# EAGLE design Polivator (EAGLE 7.7.0)
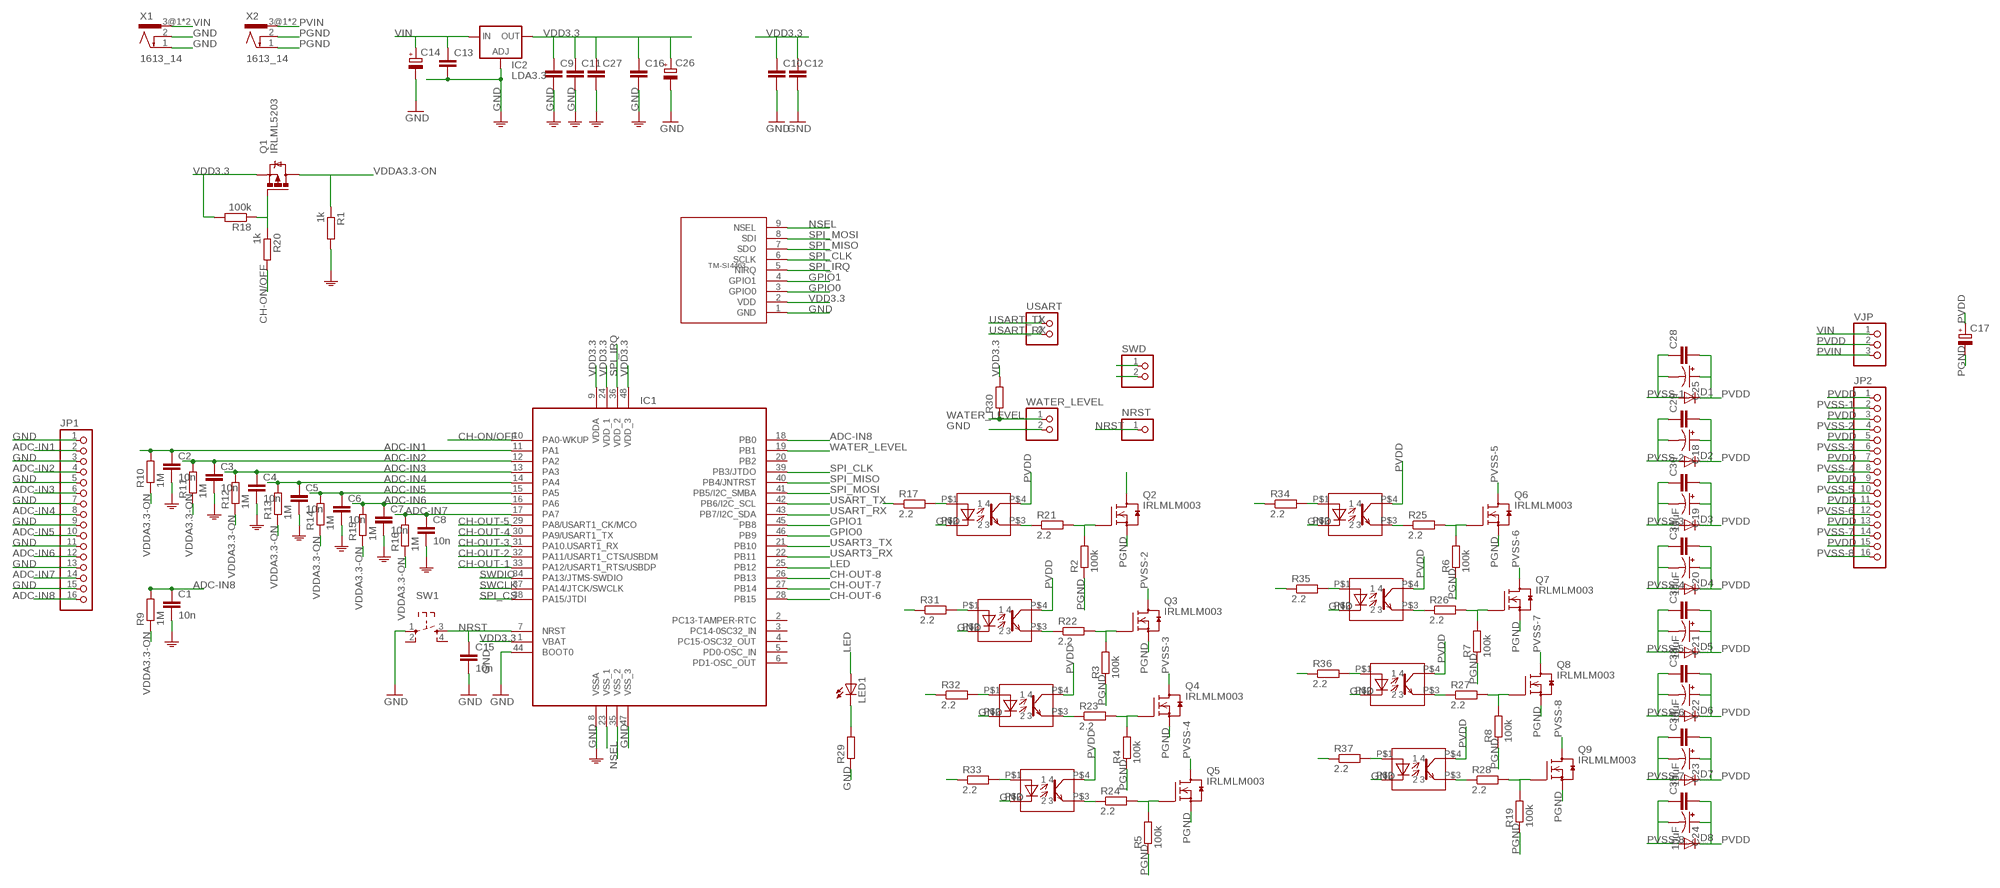
[diagram p0: schematic, sheet 1]

## Parts
C1  10n  C-EUC0805  [C0805]
C2  10n  C-EUC0805  [C0805]
C3  10n  C-EUC0805  [C0805]
C4  10n  C-EUC0805  [C0805]
C5  10n  C-EUC0805  [C0805]
C6  10n  C-EUC0805  [C0805]
C7  10n  C-EUC0805  [C0805]
C8  10n  C-EUC0805  [C0805]
C9  C-EUC3216  [C3216]
C10  C-EUC3216  [C3216]
C11  C-EUC0805  [C0805]
C12  C-EUC0805  [C0805]
C13  C-EUC1808  [C1808]
C14  CPOL-EUE2.5-5  [E2,5-5]
C15  10n  C-EUC0805  [C0805]
C16  C-EUC0805  [C0805]
C17  CPOL-EUE2.5-6  [E2,5-6]
C18  CAP_POL1206  [EIA3216]
C19  10uF  10UF-16V-10%(TANT)  [EIA3216]
C20  10uF  10UF-16V-10%(TANT)  [EIA3216]
C21  10uF  10UF-16V-10%(TANT)  [EIA3216]
C22  10uF  10UF-16V-10%(TANT)  [EIA3216]
C23  10uF  10UF-16V-10%(TANT)  [EIA3216]
C24  10uF  10UF-16V-10%(TANT)  [EIA3216]
C25  CAP_POL1206  [EIA3216]
C26  CPOL-EUE2.5-5  [E2,5-5]
C27  C-EUC0805  [C0805]
C28  C-EUC0805  [C0805]
C29  C-EUC0805  [C0805]
C30  C-EUC0805  [C0805]
C31  C-EUC0805  [C0805]
C32  C-EUC0805  [C0805]
C33  C-EUC0805  [C0805]
C34  C-EUC0805  [C0805]
C35  C-EUC0805  [C0805]
D1  DIODE-SOD80C  [SOD80C]
D2  DIODE-SOD80C  [SOD80C]
D3  DIODE-SOD80C  [SOD80C]
D4  DIODE-SOD80C  [SOD80C]
D5  DIODE-SOD80C  [SOD80C]
D6  DIODE-SOD80C  [SOD80C]
D7  DIODE-SOD80C  [SOD80C]
D8  DIODE-SOD80C  [SOD80C]
IC1  IC_UC_STM32  [LQFP48]
IC2  LDA3.3  LD117ASTR  [SOT223]
JP1  PINHD-1X16  [1X16]
JP2  PINHD-1X16  [1X16]
LED1  LEDCHIPLED_0805  [CHIPLED_0805]
NRST  PINHD-1X1  [1X01]
Q1  IRLML5203  [MICRO3]
Q2  IRLMLM003  BSS138  [SOT23]
Q3  IRLMLM003  BSS138  [SOT23]
Q4  IRLMLM003  BSS138  [SOT23]
Q5  IRLMLM003  BSS138  [SOT23]
Q6  IRLMLM003  BSS138  [SOT23]
Q7  IRLMLM003  BSS138  [SOT23]
Q8  IRLMLM003  BSS138  [SOT23]
Q9  IRLMLM003  BSS138  [SOT23]
R1  1k  R-EU_R0805  [R0805]
R2  100k  R-EU_R0805  [R0805]
R3  100k  R-EU_R0805  [R0805]
R4  100k  R-EU_R0805  [R0805]
R5  100k  R-EU_R0805  [R0805]
R6  100k  R-EU_R0805  [R0805]
R7  100k  R-EU_R0805  [R0805]
R8  100k  R-EU_R0805  [R0805]
R9  1M  R-EU_R0805  [R0805]
R10  1M  R-EU_R0805  [R0805]
R11  1M  R-EU_R0805  [R0805]
R12  1M  R-EU_R0805  [R0805]
R13  1M  R-EU_R0805  [R0805]
R14  1M  R-EU_R0805  [R0805]
R15  1M  R-EU_R0805  [R0805]
R16  1M  R-EU_R0805  [R0805]
R17  2.2  R-EU_R0805  [R0805]
R18  100k  R-EU_R0805  [R0805]
R19  100k  R-EU_R0805  [R0805]
R20  1k  R-EU_R0805  [R0805]
R21  2.2  R-EU_R0805  [R0805]
R22  2.2  R-EU_R0805  [R0805]
R23  2.2  R-EU_R0805  [R0805]
R24  2.2  R-EU_R0805  [R0805]
R25  2.2  R-EU_R0805  [R0805]
R26  2.2  R-EU_R0805  [R0805]
R27  2.2  R-EU_R0805  [R0805]
R28  2.2  R-EU_R0805  [R0805]
R29  R-EU_R0805  [R0805]
R30  R-EU_R0805  [R0805]
R31  2.2  R-EU_R0805  [R0805]
R32  2.2  R-EU_R0805  [R0805]
R33  2.2  R-EU_R0805  [R0805]
R34  2.2  R-EU_R0805  [R0805]
R35  2.2  R-EU_R0805  [R0805]
R36  2.2  R-EU_R0805  [R0805]
R37  2.2  R-EU_R0805  [R0805]
SW1  SW_TACT_4P  [SW_TACT_SMALL]
SWD  PINHD-1X2  [1X02]
U$8  TM-SI4463  [TM-SI4463-SMD]
U$10  PC817-SMD  [PC817-SMD]
U$11  PC817-SMD  [PC817-SMD]
U$13  PC817-SMD  [PC817-SMD]
U$16  PC817-SMD  [PC817-SMD]
U$18  PC817-SMD  [PC817-SMD]
U$20  PC817-SMD  [PC817-SMD]
U$23  PC817-SMD  [PC817-SMD]
U$24  PC817-SMD  [PC817-SMD]
USART  PINHD-1X2  [1X02]
VJP  PINHD-1X3  [1X03]
WATER_LEVEL  PINHD-1X2  [1X02]
X1  1613_14  [1613_14]
X2  1613_14  [1613_14]

## Nets
ADC-IN1: C2.1 IC1.11(PA1) JP1.2 R10.2
ADC-IN2: C3.1 IC1.12(PA2) JP1.4 R11.2
ADC-IN3: C4.1 IC1.13(PA3) JP1.6 R12.2
ADC-IN4: C5.1 IC1.14(PA4) JP1.8 R13.2
ADC-IN5: C6.1 IC1.15(PA5) JP1.10 R14.2
ADC-IN6: C7.1 IC1.16(PA6) JP1.12 R15.2
ADC-IN7: C8.1 IC1.17(PA7) JP1.14 R16.2
ADC-IN8: C1.1 IC1.18(PB0) JP1.16 R9.2
CH-ON/OFF: IC1.10(PA0-WKUP) R20.2
CH-OUT-1: IC1.33(PA12/USART1_RTS/USBDP) R17.1
CH-OUT-2: IC1.32(PA11/USART1_CTS/USBDM) R31.1
CH-OUT-3: IC1.31(PA10.USART1_RX) R32.1
CH-OUT-4: IC1.30(PA9/USART1_TX) R33.1
CH-OUT-5: IC1.29(PA8/USART1_CK/MCO) R34.1
CH-OUT-6: IC1.28(PB15) R35.1
CH-OUT-7: IC1.27(PB14) R36.1
CH-OUT-8: IC1.26(PB13) R37.1
GND: C1.2 C2.2 C3.2 C4.2 C5.2 C6.2 C7.2 C8.2 C9.2 C10.2 C11.2 C12.2 C13.2 C14.- C15.2 C16.2 C26.- C27.2 IC1.8(VSSA) IC1.23(VSS_1) IC1.44(BOOT0) IC1.47(VSS_3) IC2.1(ADJ) JP1.1 JP1.3 JP1.5 JP1.7 JP1.9 JP1.11 JP1.13 JP1.15 R1.2 R29.1 SW1.1 U$8.1(GND) U$10.P$2 U$11.P$2 U$13.P$2 U$16.P$2 U$18.P$2 U$20.P$2 U$23.P$2 U$24.P$2 WATER_LEVEL.2 X1.1 X1.2 ; supply symbol labelled AGND
GPIO0: IC1.46(PB9) U$8.3(GPIO0)
GPIO1: IC1.45(PB8) U$8.4(GPIO1)
LED: IC1.25(PB12) LED1.A
N$1: LED1.C R29.2
N$2: Q2.1(G) R2.2 R21.2
N$3: Q3.1(G) R3.2 R22.2
N$4: Q1.1(G) R18.1 R20.1
N$5: Q4.1(G) R4.2 R23.2
N$6: R21.1 U$10.P$3
N$7: R22.1 U$11.P$3
N$8: Q5.1(G) R5.2 R24.2
N$9: Q6.1(G) R6.2 R25.2
N$10: Q7.1(G) R7.2 R26.2
N$11: Q8.1(G) R8.2 R27.2
N$12: Q9.1(G) R19.2 R28.2
N$13: R23.1 U$13.P$3
N$14: R24.1 U$16.P$3
N$15: R25.1 U$18.P$3
N$16: R26.1 U$20.P$3
N$17: R27.1 U$23.P$3
N$18: R28.1 U$24.P$3
N$19: R17.2 U$10.P$1
N$20: R31.2 U$11.P$1
N$21: R32.2 U$13.P$1
N$22: R33.2 U$16.P$1
N$23: R37.2 U$24.P$1
N$24: R36.2 U$23.P$1
N$25: R35.2 U$20.P$1
N$26: R34.2 U$18.P$1
NRST: C15.1 IC1.7(NRST) NRST.1 SW1.3
NSEL: IC1.35(VSS_2) U$8.9(NSEL)
PGND: C17.- Q2.2(S) Q3.2(S) Q4.2(S) Q5.2(S) Q6.2(S) Q7.2(S) Q8.2(S) Q9.2(S) R2.1 R3.1 R4.1 R5.1 R6.1 R7.1 R8.1 R19.1 X2.1 X2.2
PVDD: C17.+ C18.A(+) C19.A(+) C20.A(+) C21.A(+) C22.A(+) C23.A(+) C24.A(+) C25.A(+) C28.2 C29.2 C30.2 C31.2 C32.2 C33.2 C34.2 C35.2 D1.C D2.C D3.C D4.C D5.C D6.C D7.C D8.C JP2.1 JP2.3 JP2.5 JP2.7 JP2.9 JP2.11 JP2.13 JP2.15 U$10.P$4 U$11.P$4 U$13.P$4 U$16.P$4 U$18.P$4 U$20.P$4 U$23.P$4 U$24.P$4 VJP.2
PVIN: VJP.3 X2.3@1 X2.3@2
PVSS-1: C25.C(-) C28.1 D1.A JP2.2 Q2.3(D)
PVSS-2: C18.C(-) C29.1 D2.A JP2.4 Q3.3(D)
PVSS-3: C19.C(-) C30.1 D3.A JP2.6 Q4.3(D)
PVSS-4: C20.C(-) C31.1 D4.A JP2.8 Q5.3(D)
PVSS-5: C21.C(-) C32.1 D5.A JP2.10 Q6.3(D)
PVSS-6: C22.C(-) C33.1 D6.A JP2.12 Q7.3(D)
PVSS-7: C23.C(-) C34.1 D7.A JP2.14 Q8.3(D)
PVSS-8: C24.C(-) C35.1 D8.A JP2.16 Q9.3(D)
SPI_CLK: IC1.39(PB3/JTDO) U$8.6(SCLK)
SPI_CS: IC1.38(PA15/JTDI)
SPI_IRQ: IC1.36(VDD_2) U$8.5(NIRQ)
SPI_MISO: IC1.40(PB4/JNTRST) U$8.7(SDO)
SPI_MOSI: IC1.41(PB5/I2C_SMBA) U$8.8(SDI)
SWCLK: IC1.37(PA14/JTCK/SWCLK) SWD.2
SWDIO: IC1.34(PA13/JTMS-SWDIO) SWD.1
USART3_RX: IC1.22(PB11)
USART3_TX: IC1.21(PB10)
USART_RX: IC1.43(PB7/I2C_SDA) USART.2
USART_TX: IC1.42(PB6/I2C_SCL) USART.1
VDD3.3: C9.1 C10.1 C11.1 C12.1 C16.1 C26.+ C27.1 IC1.1(VBAT) IC1.9(VDDA) IC1.24(VDD_1) IC1.48(VDD_3) IC2.4(OUT) Q1.2(S) R18.2 R30.2 U$8.2(VDD)
VDDA3.3-ON: Q1.3(D) R1.1 R9.1 R10.1 R11.1 R12.1 R13.1 R14.1 R15.1 R16.1
VIN: C13.1 C14.+ IC2.3(IN) VJP.1 X1.3@1 X1.3@2
WATER_LEVEL: IC1.19(PB1) R30.1 WATER_LEVEL.1
Unconnected: IC1.2(PC13-TAMPER-RTC) IC1.3(PC14-0SC32_IN) IC1.4(PC15-OSC32_OUT) IC1.5(PD0-OSC_IN) IC1.6(PD1-OSC_OUT) IC1.20(PB2) SW1.2 SW1.4

## Library data of the parts
C1-C13 C15 C16 C27-C35 = resistor:C-EU: CAPACITOR, European symbol
C14 C17 C26 = resistor:CPOL-EU: POLARIZED CAPACITOR, European symbol
C18 C25 = SparkFun-Passives:CAP_POL: Capacitor Polarized These are standard SMD and PTH capacitors. Normally 10uF, 47uF, and 100uF in electrolytic and tantalum varieties. Always verify the external diameter of the through hole cap, it varies with capacity, voltage, and manufacturer. The EIA devices should be standard.
C19-C24 = SparkFun-Capacitors:10UF-16V-10%(TANT): CAP-00811 1206/EIA-3216 Tantalum capacitor; PROD_ID: CAP-00811
D1-D8 = diode:DIODE-: DIODE
IC1 = dp_devices:IC_UC_STM32: STM32F102C6
IC2 = v-reg:LD117A?*: Low drop fixed and adjustable positive voltage regulators 1 A Source: http://www.st.com/stonline/products/literature/ds/7194/ld1117axx.pdf
JP1 JP2 = pinhead:PINHD-1X16: PIN HEADER
LED1 = adafruit:LED: LED OSRAM: - CHIPLED LG R971, LG N971, LY N971, LG Q971, LY Q971, LO R971, LY R971 LH N974, LH R974 LS Q976, LO Q976, LY Q976 LO Q996 - Hyper CHIPLED LW Q18S LB Q993, LB Q99A, LB R99A - SideLED LS A670, LO A670, LY A670, LG A670, LP A670 LB A673, LV A673, LT A673, LW A673 LH A674 LY A675 LS A676, LA A676, LO A676, LY A676, LW A676 LS A679, LY A679, LG A679 - Hyper Micro SIDELED® LS Y876, LA Y876, LO Y876, LY Y876 LT Y87S - SmartLED LW L88C, LW L88S LB L89C, LB L89S, LG L890 LS L89K, LO L89K, LY L89K LS L896, LA L896, LO L896, LY L896 - TOPLED LS T670, LO T670, LY T670, LG T670, LP T670 LSG T670, LSP T670, LSY T670, LOP T670, LYG T670 LG T671, LOG T671, LSG T671 LB T673, LV T673, LT T673, LW T673 LH T674 LS T676, LA T676, LO T676, LY T676, LB T676, LH T676, LSB T676, LW T676 LB T67C, LV T67C, LT T67C, LS T67K, LO T67K, LY T67K, LW E67C LS E67B, LA E67B, LO E67B, LY E67B, LB E67C, LV E67C, LT E67C LW T67C LS T679, LY T679, LG T679 LS T770, LO T770, LY T770, LG T770, LP T770 LB T773, LV T773, LT T773, LW T773 LH T774 LS E675, LA E675, LY E675, LS T675 LS T776, LA T776, LO T776, LY T776, LB T776 LHGB T686 LT T68C, LB T68C - Hyper Mini TOPLED® LB M676 - Mini TOPLED Santana® LG M470 LS M47K, LO M47K, LY M47K Source: http://www.osram.convergy.de/
NRST = pinhead:PINHD-1X1: PIN HEADER
Q1 = transistor-power:IRLML5203: HEXFET P-Channel Power MOSFET
Q2-Q9 = m-pad-2.1:BSS138: Fairchild Semiconductors BSS138 N-Channel Logic Level Enhancement Mode Field Effect Transistor General Description: These N-Channel enhancement mode field effect transistors are produced using Fairchild's proprietary, high cell density, DMOS technology. These products have been designed to minimize on-state resistance while provide rugged, reliable, and fast switching performance.These products are particularly suited for low voltage, low current applications such as small servo motor control, power MOSFET gate drivers, and other switching applications. Features: 0.22 A, 50 V. RDS(ON) = 3.5Ohm @ VGS = 10 V RDS(ON) = 6.0Ohm @ VGS = 4.5 V High density cell design for extremely low RDS(ON) Rugged and Reliable Compact industry standard SOT-23 surface mount package Please send any comments to: messi@users.sourceforge.net
R1-R37 = resistor:R-EU_: RESISTOR, European symbol
SW1 = dp_devices:SW_TACT_4P
SWD USART WATER_LEVEL = pinhead:PINHD-1X2: PIN HEADER
U$8 = RemoteSwitchComponents:TM-SI4463
U$10 U$11 U$13 U$16 U$18 U$20 U$23 U$24 = RemoteSwitchComponents:PC817-SMD
VJP = pinhead:PINHD-1X3: PIN HEADER
X1 X2 = con-lumberg:1613_14: Power supply connectors / Netzgeräte-Steckverbinder Source: Data sheet <http://www.farnell.com/datasheets/1733496.pdf>; MF: LUMBERG; MPN: 1613 14; OC_FARNELL: 1243245

## Board
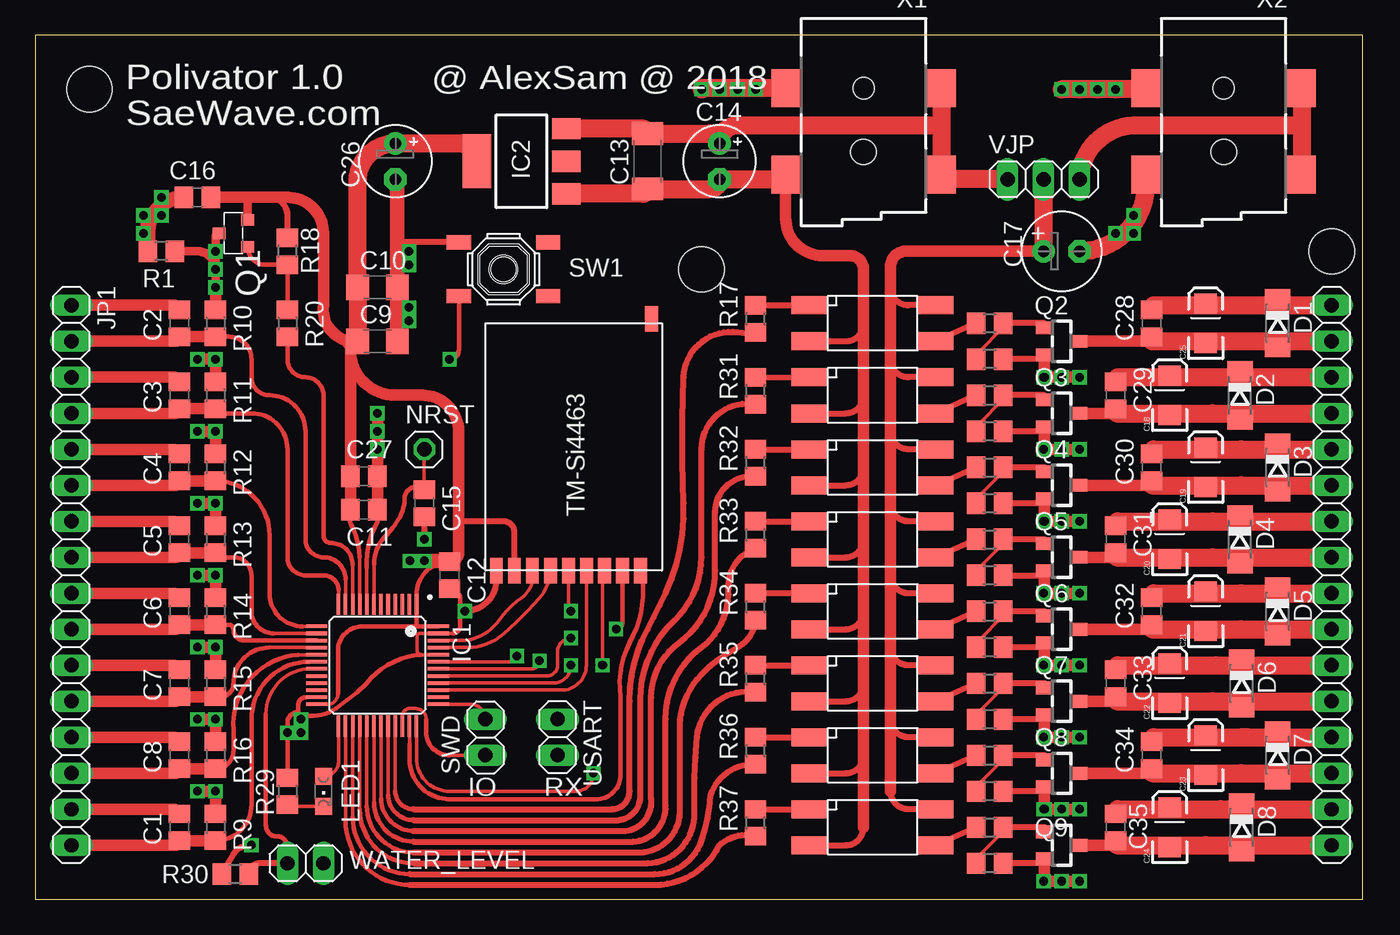
[diagram p1: board, top side]
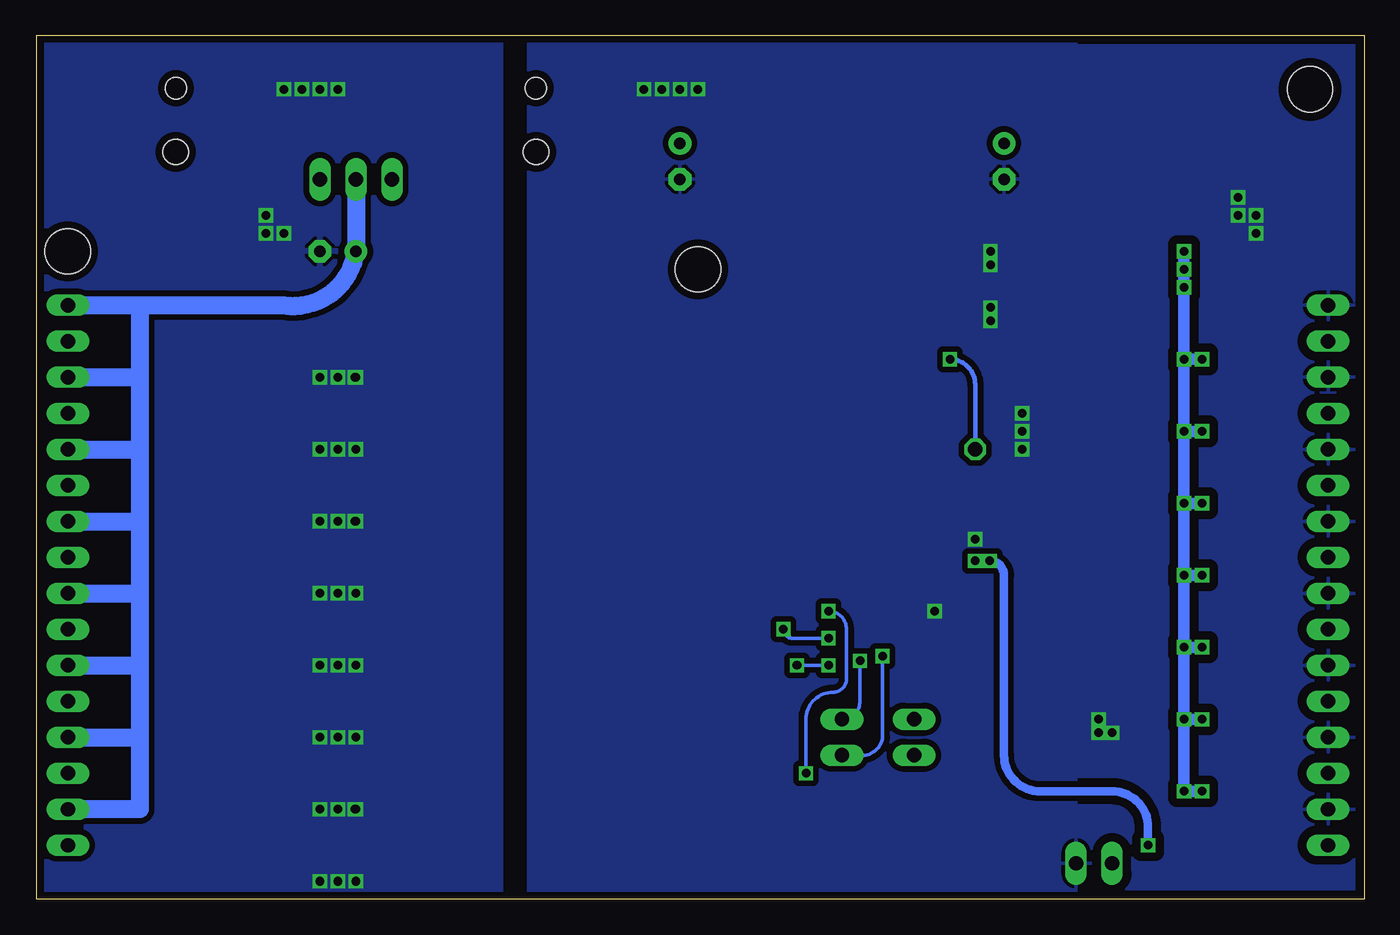
[diagram p2: board, bottom side, seen from below]

Size 93.65 x 60.95 mm. Coordinates in mm from the lower left corner, seen from the top.
Outline: 0,0 93.65,0 93.65,60.95 0,60.95 0,0
Copper layers (1*16): Top 0.035mm / dielectric 1.5mm / Bottom 0.035mm
Design rules "default *": minimum track width 6mil, minimum drill 18mil, track to track 8mil, track to pad 8mil, pad to pad 8mil, via to via 8mil, smd to smd 8mil, copper to edge 20mil, drill to drill 8mil, minimum pad ring 10mil, minimum via ring 8mil, stop-mask expansion 4mil, vias tented up to drill 24mil, thermal gap 10mil
Holes 3.2 mm at 3.81,57.15 91.44,45.72 46.99,44.45

### Footprints (pad centres in the part's own frame; a part is rotated, then mirrored left to right if it is on the bottom)
C0805 = smd 1.3 x 1.5: 1 -0.95,0; 2 0.95,0
C3216 = smd 1.6 x 1.8: 1 -1.4,0; 2 1.4,0
C1808 = smd 1.6 x 2.2: 1 -1.95,0; 2 1.95,0
E2,5-5 = drill 0.813 pad 1.6: + -1.27,0 | drill 0.813 pad 1.6 octagon: - 1.27,0
E2,5-6 = drill 0.813 pad 1.6: + -1.27,0 | drill 0.813 pad 1.6 octagon: - 1.27,0
EIA3216 = smd 1.4 x 1.6: A 1.4,0; C -1.4,0
SOD80C = smd 1.4 x 1.8: A 1.7,0; C -1.7,0
LQFP48 = smd 1.5 x 0.25: 1 -4.3,2.75; 2 -4.3,2.25; 3 -4.3,1.75; 4 -4.3,1.25; 5 -4.3,0.75; 6 -4.3,0.25; 7 -4.3,-0.25; 8 -4.3,-0.75; 9 -4.3,-1.25; 10 -4.3,-1.75; 11 -4.3,-2.25; 12 -4.3,-2.75; 25 4.3,-2.75; 26 4.3,-2.25; 27 4.3,-1.75; 28 4.3,-1.25; 29 4.3,-0.75; 30 4.3,-0.25; 31 4.3,0.25; 32 4.3,0.75; 33 4.3,1.25; 34 4.3,1.75; 35 4.3,2.25; 36 4.3,2.75 | smd 0.25 x 1.5: 13 -2.75,-4.3; 14 -2.25,-4.3; 15 -1.75,-4.3; 16 -1.25,-4.3; 17 -0.75,-4.3; 18 -0.25,-4.3; 19 0.25,-4.3; 20 0.75,-4.3; 21 1.25,-4.3; 22 1.75,-4.3; 23 2.25,-4.3; 24 2.75,-4.3; 37 2.75,4.3; 38 2.25,4.3; 39 1.75,4.3; 40 1.25,4.3; 41 0.75,4.3; 42 0.25,4.3; 43 -0.25,4.3; 44 -0.75,4.3; 45 -1.25,4.3; 46 -1.75,4.3; 47 -2.25,4.3; 48 -2.75,4.3
SOT223 = smd 1.5 x 2: 1 -2.3,-3.15; 2 0,-3.15; 3 2.3,-3.15 | smd 3.8 x 2: 4 0,3.15
1X16 = drill 1.016 long: 1 -19.05,0; 2 -16.51,0; 3 -13.97,0; 4 -11.43,0; 5 -8.89,0; 6 -6.35,0; 7 -3.81,0; 8 -1.27,0; 9 1.27,0; 10 3.81,0; 11 6.35,0; 12 8.89,0; 13 11.43,0; 14 13.97,0; 15 16.51,0; 16 19.05,0
CHIPLED_0805 = smd 1.2 x 1.2: A 0,-1.05; C 0,1.05
1X01 = drill 1.016 octagon: 1 0,0
MICRO3 = smd 0.8 x 0.9: 1 -0.95,-1; 2 0.95,-1; 3 0,1
SOT23 = smd 0.9 x 1.2: 1 -0.95,-1.2; 2 0.95,-1.2; 3 0,1.2
R0805 = smd 1.3 x 1.5: 1 -0.95,0; 2 0.95,0
SW_TACT_SMALL = smd 1.7 x 1: 1 -3.15,1.9; 2 3.15,1.9; 3 -3.15,-1.9; 4 3.15,-1.9
1X02 = drill 1.016 long: 1 -1.27,0; 2 1.27,0
TM-SI4463-SMD = smd 1.778 x 0.914: 1 8.572,-5.588; 2 8.572,-4.318; 3 8.572,-3.048; 4 8.572,-1.778; 5 8.572,-0.508; 6 8.572,0.762; 7 8.572,2.032; 8 8.572,3.302; 9 8.572,4.572; 10 -9.207,5.366
PC817-SMD = smd 2.54 x 1.27: P$1 -4.445,1.27; P$2 -4.445,-1.27; P$3 4.445,-1.27; P$4 4.445,1.27
1X03 = drill 1.016 long: 1 -2.54,0; 2 0,0; 3 2.54,0
1613_14 = smd 2 x 2.7: 1 5.5,5; 2 5.5,11.1; 3@1 -5.5,11.1; 3@2 -5.5,5 | hole 1.5: 0,5 | hole 1.8: 0,9.5

### Placement (x,y rotation side)
C1  10.16,5.08 90 top
C2  10.16,40.64 90 top
C3  10.16,35.56 90 top
C4  10.16,30.48 90 top
C5  10.16,25.4 90 top
C6  10.16,20.32 90 top
C7  10.16,15.24 90 top
C8  10.16,10.16 90 top
C9  24.13,39.37 0 top
C10  24.13,43.18 0 top
C11  23.18,27.49 0 top
C12  29.21,22.86 270 top
C13  43.18,52.07 270 top
C14  48.26,52.07 270 top
C15  27.43,27.94 270 top
C16  11.43,49.53 180 top
C17  72.39,45.72 0 top
C18  80.01,35.56 90 top
C19  82.55,30.48 90 top
C20  80.01,25.4 90 top
C21  82.55,20.32 90 top
C22  80.01,15.24 90 top
C23  82.55,10.16 90 top
C24  80.01,5.08 90 top
C25  82.55,40.64 90 top
C26  25.4,52.07 270 top
C27  23.18,29.84 0 top
C28  78.74,40.64 90 top
C29  76.2,35.56 90 top
C30  78.74,30.48 90 top
C31  76.2,25.4 90 top
C32  78.74,20.32 90 top
C33  76.2,15.24 90 top
C34  78.74,10.16 90 top
C35  76.2,5.08 90 top
D1  87.63,40.64 270 top
D2  84.96,35.56 270 top
D3  87.63,30.48 270 top
D4  84.96,25.4 270 top
D5  87.63,20.32 270 top
D6  85.09,15.24 270 top
D7  87.63,10.16 270 top
D8  85.09,5.08 270 top
IC1  24.13,16.51 270 top
IC2  34.29,52.07 90 top
JP1  2.54,22.86 270 top
JP2  91.44,22.86 270 top
LED1  20.32,7.62 180 top
NRST  27.43,31.75 0 top
Q1  13.97,46.99 90 top
Q2  72.39,39.37 270 top
Q3  72.39,34.29 270 top
Q4  72.39,29.21 270 top
Q5  72.39,24.13 270 top
Q6  72.39,19.05 270 top
Q7  72.39,13.97 270 top
Q8  72.39,8.89 270 top
Q9  72.39,3.81 270 top
R1  8.89,45.72 180 top
R2  67.31,38.1 180 top
R3  67.31,33.02 180 top
R4  67.31,27.94 180 top
R5  67.31,22.86 180 top
R6  67.31,17.78 180 top
R7  67.31,12.7 180 top
R8  67.31,7.62 180 top
R9  12.7,5.08 270 top
R10  12.7,40.64 270 top
R11  12.7,35.56 270 top
R12  12.7,30.48 270 top
R13  12.7,25.4 270 top
R14  12.7,20.32 270 top
R15  12.7,15.24 270 top
R16  12.7,10.16 270 top
R17  50.8,40.96 90 top
R18  17.78,45.72 90 top
R19  67.31,2.54 180 top
R20  17.78,40.64 270 top
R21  67.31,40.64 0 top
R22  67.31,35.56 0 top
R23  67.31,30.48 0 top
R24  67.31,25.4 0 top
R25  67.31,20.32 0 top
R26  67.31,15.24 0 top
R27  67.31,10.16 0 top
R28  67.31,5.08 0 top
R29  17.78,7.62 270 top
R30  14.1,1.78 180 top
R31  50.8,35.88 90 top
R32  50.8,30.8 90 top
R33  50.8,25.72 90 top
R34  50.8,20.64 90 top
R35  50.8,15.56 90 top
R36  50.8,10.48 90 top
R37  50.8,5.4 90 top
SW1  33.02,44.45 0 top
SWD  31.75,11.43 90 top
U$8  38.1,31.75 270 top
U$10  59.05,40.64 0 top
U$11  59.05,35.56 0 top
U$13  59.05,30.48 0 top
U$16  59.05,25.4 0 top
U$18  59.05,20.32 0 top
U$20  59.05,15.24 0 top
U$23  59.05,10.16 0 top
U$24  59.05,5.08 0 top
USART  36.83,11.43 270 top
VJP  71.12,50.8 0 top
WATER_LEVEL  19.05,2.54 0 top
X1  58.42,62.23 180 top
X2  83.82,62.23 180 top

### Tracks (layer width: path | path; a pad name or v marks a point on that pad's centre or on a via)
ADC-IN1
  Top 0.254: IC1.11 21.88,22.57
  Top 0.305: 21.88,22.57 arc90 20.32,24.13 arc-90 19.05,25.4 19.05,33.02 arc90 16.51,35.56 arc-90 15.24,36.83 15.24,38.1 arc90 13.65,39.69 R10.2
  Top 0.813: JP1.2 9.84,39.37 arc90 C2.1 R10.2
ADC-IN2
  Top 0.254: IC1.12 21.38,21.8 | 13.02,34.29 arc-90 R11.2
  Top 0.305: 21.38,21.8 arc90 20.32,22.86 19.05,22.86 arc-90 17.78,24.13 17.78,31.75 arc90 15.24,34.29 13.02,34.29
  Top 0.813: JP1.4 9.84,34.29 arc90 C3.1 R11.2
ADC-IN3
  Top 0.254: IC1.13 18.84,19.26
  Top 0.305: 18.84,19.26 arc-90 16.51,21.59 16.51,25.72 arc90 R12.2
  Top 0.813: JP1.6 9.84,29.21 arc90 C4.1 R12.2
ADC-IN4
  Top 0.254: IC1.14 16.8,18.76 | 13.02,24.13 arc-90 R13.2
  Top 0.305: 16.8,18.76 arc-90 15.24,20.32 15.24,22.86 arc90 13.97,24.13 13.02,24.13
  Top 0.813: JP1.8 9.84,24.13 arc90 C5.1 R13.2
ADC-IN5
  Top 0.305: IC1.15 14.76,18.26 arc-90 13.97,19.05 arc90 13.65,19.37 R14.2
  Top 0.813: JP1.10 9.84,19.05 arc90 C6.1 R14.2
ADC-IN6
  Top 0.254: IC1.16 16.49,17.76 | 13.02,14.29 R15.2
  Top 0.305: 16.49,17.76 arc90 13.97,15.24 arc-90 13.02,14.29
  Top 0.813: JP1.12 9.84,13.97 arc90 C7.1 R15.2
ADC-IN7
  Top 0.254: IC1.17 18.53,17.26
  Top 0.305: 18.53,17.26 arc90 13.97,11.94 13.97,10.48 arc-90 R16.2
  Top 0.813: JP1.14 9.84,8.89 arc90 C8.1 R16.2
ADC-IN8
  Top 0.254: IC1.18 19.3,16.76
  Top 0.305: 19.3,16.76 arc90 15.24,12.7 15.24,6.67 arc-90 R9.2
  Top 0.813: JP1.16 9.84,3.81 arc90 C1.1 R9.2
CH-ON/OFF
  Top 0.254: IC1.10 22.38,23.59
  Top 0.305: 22.38,23.59 arc90 20.83,25.15 arc-90 20.32,25.65 20.32,35.56 arc90 19.05,36.83 arc-90 17.78,38.1 R20.2
CH-OUT-1
  Top 0.254: IC1.33 25.38,7.64
  Top 0.305: 25.38,7.64 arc90 26.67,6.35
  Top 0.406: 26.67,6.35 40.64,6.35 arc90 41.91,7.62 41.91,13.97 arc-28 43.18,19.05 arc3 44.45,21.59 arc27 45.72,27.94 arc-5 45.72,36.83 arc-95 49.53,40.01 arc16 R17.1
CH-OUT-2
  Top 0.254: IC1.32 24.88,7.38
  Top 0.305: 24.88,7.38 arc90 26.67,5.59
  Top 0.406: 26.67,5.59 41.15,5.59 arc90 42.67,7.49 42.67,14.1 arc-47 45.09,19.68 arc47 46.99,24.13 arc-1 46.99,31.75 arc-100 R31.1
CH-OUT-3
  Top 0.254: IC1.31 24.38,7.12
  Top 0.305: 24.38,7.12 arc90 26.67,4.83
  Top 0.406: 26.67,4.83 41.66,4.83 arc90 43.43,7.11 43.43,14.22 arc-54 45.4,18.1 arc55 47.94,23.18 arc-1 47.94,27.3 arc-95 R32.1
CH-OUT-4
  Top 0.254: IC1.30 23.88,6.85
  Top 0.305: 23.88,6.85 arc90 26.67,4.06
  Top 0.406: 26.67,4.06 42.16,4.06 arc90 44.45,6.6 44.45,12.7 arc-53 46.99,17.78 arc57 48.9,21.91 arc-74 R33.1 50.16,24.45
CH-OUT-5
  Top 0.254: IC1.29 23.38,6.59
  Top 0.305: 23.38,6.59 arc90 26.67,3.3
  Top 0.406: 26.67,3.3 42.67,3.3 arc90 45.47,6.35 45.47,12.13 arc-44 46.99,15.88 arc-18 49.53,17.78 arc57 R34.1
CH-OUT-6
  Top 0.254: IC1.28 22.88,6.33
  Top 0.305: 22.88,6.33 arc90 26.67,2.54
  Top 0.406: 26.67,2.54 43.18,2.54 arc90 46.48,6.1 46.48,7.11 arc-5 46.67,11.43 arc-95 R35.1
CH-OUT-7
  Top 0.254: IC1.27 22.38,5.81
  Top 0.305: 22.38,5.81 arc90 26.42,1.78
  Top 0.406: 26.42,1.78 43.69,1.78 arc71 46.99,4.13 arc16 47.62,7.3 arc-76 R36.1
CH-OUT-8
  Top 0.254: IC1.26 21.88,5.55
  Top 0.305: 21.88,5.55 arc90 26.42,1.02
  Top 0.406: 26.42,1.02 43.69,1.02 arc40 46.99,2.22 arc22 48.26,3.81 arc-58 R37.1
GND  (via drill 0.6)  (1 unrouted)
  Top 0.254: 24.13,26.67 arc62 C11.2 | IC1.8 23.38,23.36 23.37,23.37 | 29.43,18.76 IC1.47 27.14,18.76 arc90 26.92,18.54 26.92,17.53 arc90 27.19,17.26 IC1.44 | IC1.23 19.09,14.26
  Top 0.305: 19.09,14.26 arc90 18.54,13.72 18.54,13.21 | 18.54,13.21 arc90 19.05,12.95 arc41 21.21,13.46 arc8 23.37,15.24 arc-48 27.19,17.26 | R29.1 v17.78,11.75 | v17.78,11.75 17.78,12.45 arc-90 18.54,13.21 | v18.73,12.7 v18.73,11.75 v17.78,11.75 | 23.37,23.37 arc-31 24.13,26.67 | 29.43,18.76 arc90 29.97,19.3 29.97,20.32 29.97,21.15 arc90 C12.2
  Top 0.406: C15.2 v27.43,25.4 | 29.97,20.32 v30.29,20.32 arc90 32.51,22.54 U$8.1 | v8.89,49.53 v8.89,48.26 v7.62,48.26 v7.62,46.99 7.94,46.99 | 25.53,50.67 arc90 C26.- | SW1.1 26.17,46.35 arc-90 25.53,46.99 | 9.84,41.91 arc90 C2.2 | 9.84,36.83 arc90 C3.2 | 9.84,31.75 arc90 C4.2 | 9.84,26.67 arc90 C5.2 | 9.84,21.59 arc90 C6.2 | 9.84,16.51 arc90 C7.2 | 9.84,11.43 arc90 C8.2 | 9.84,6.35 arc90 C1.2 | U$23.P$2 57.15,8.89 arc90 58.42,10.16 | U$24.P$2 57.15,3.81 arc90 58.42,5.08 | U$20.P$2 57.15,13.97 arc90 58.42,15.24 | U$18.P$2 57.15,19.05 arc90 58.42,20.32 | U$16.P$2 57.15,24.13 arc90 58.42,25.4 | U$13.P$2 57.15,29.21 arc90 58.42,30.48 | U$11.P$2 57.15,34.29 arc90 58.42,35.56 | U$10.P$2 57.15,39.37 arc90 58.42,40.64
  Top 0.813: 9.84,41.91 JP1.1 | 9.84,36.83 JP1.3 | 9.84,31.75 JP1.5 | 9.84,26.67 JP1.7 | 9.84,21.59 JP1.9 | 9.84,16.51 JP1.11 | 9.84,11.43 JP1.13 | 9.84,6.35 JP1.15 | 58.42,5.08 58.42,10.16 58.42,15.24 58.42,20.32 58.42,25.4 58.42,30.48 58.42,35.56 58.42,40.64 58.42,44.45 arc90 57.47,45.4 55.56,45.4 arc-90 52.92,48.05 X1.2 | v24.13,34.29 C27.2 C11.2
  Top 1.016: C16.2 arc90 7.94,46.99 R1.2 | C9.2 C10.2 25.53,46.99 25.53,50.67 arc90 C26.-
  Top 1.27: IC2.1 42.83,49.77 arc90 C13.2 47.58,50.12 arc90 C14.- 52.59,50.8 arc90 X1.2 | 25.53,50.67 arc90 C26.- | X1.1 47.07,57.23 arc90 v46.99,57.15
  other vias: 24.13,33.02 24.13,31.75 48.26,57.15 49.53,57.15 50.8,57.15 26.35,40.8 26.35,41.75 26.35,45.72 26.35,44.77
  pour Bottom (isolate 0.61): 0,60.96 30.48,60.96 30.48,40.64 arc-90 27.94,38.1 22.86,38.1 arc90 20.32,34.29 20.32,0 0,0
  pour Bottom (isolate 0.406, rank 2): 20.32,0 20.32,60.96 58.93,61.21 58.93,0
GPIO0
  Top 0.254: IC1.46 30,18.26 arc56 32.7,19.68 arc-21 34.29,21.27 arc68 U$8.3
GPIO1
  Top 0.254: IC1.45 30.46,17.76 arc42 33.02,18.73 arc7 35.56,21.27 arc40 U$8.4
LED
  Top 0.254: IC1.25 21.38,9.73 arc-90 LED1.A
N$1
  Top 0.254: LED1.C 17.88,6.57 arc-90 R29.2
N$2
  Top 0.152: R2.2 66.26,38.25 66.22,38.28
  Top 0.254: 66.04,38.1 66.22,38.28 68.58,40.64
  Top 0.406: Q2.1 71.19,40.64 68.58,40.64 R21.2
N$3
  Top 0.152: R3.2 66.26,33.25 66.27,33.24
  Top 0.254: 66.04,33.02 66.27,33.24 68.58,35.56
  Top 0.406: Q3.1 71.19,35.56 68.58,35.56 R22.2
N$4
  Top 0.305: R20.1 R18.1 16.24,44.77 arc-90 Q1.1
N$5
  Top 0.152: R4.2 66.26,28 66.18,28.08
  Top 0.254: 66.04,27.94 66.18,28.08 68.58,30.48
  Top 0.406: Q4.1 71.19,30.48 68.58,30.48 R23.2
N$6
  Top 0.406: U$10.P$3 R21.1
N$7
  Top 0.406: U$11.P$3 R22.1
N$8
  Top 0.152: R5.2 66.26,23 66.22,23.04
  Top 0.254: 66.04,22.86 66.22,23.04 68.58,25.4
  Top 0.406: Q5.1 71.19,25.4 68.58,25.4 R24.2
N$9
  Top 0.152: 66.26,18 R6.2
  Top 0.254: 66.04,17.78 66.26,18 68.58,20.32
  Top 0.406: Q6.1 71.19,20.32 68.58,20.32 R25.2
N$10
  Top 0.152: R7.2 66.26,12.75 66.17,12.84
  Top 0.254: 66.04,12.7 66.17,12.84 68.58,15.24
  Top 0.406: Q7.1 71.19,15.24 68.58,15.24 R26.2
N$11
  Top 0.152: R8.2 66.26,7.75 66.22,7.79
  Top 0.254: 66.04,7.62 66.22,7.79 68.58,10.16
  Top 0.406: Q8.1 71.19,10.16 68.58,10.16 R27.2
N$12
  Top 0.152: R19.2 66.26,2.75 66.25,2.75
  Top 0.254: 66.04,2.54 66.25,2.75 68.58,5.08
  Top 0.406: Q9.1 71.19,5.08 68.58,5.08 R28.2
N$13
  Top 0.406: U$13.P$3 R23.1
N$14
  Top 0.406: U$16.P$3 R24.1
N$15
  Top 0.406: U$18.P$3 R25.1
N$16
  Top 0.406: U$20.P$3 R26.1
N$17
  Top 0.406: U$23.P$3 R27.1
N$18
  Top 0.406: U$24.P$3 R28.1
N$19
  Top 0.406: R17.2 U$10.P$1
N$20
  Top 0.406: R31.2 U$11.P$1
N$21
  Top 0.406: R32.2 U$13.P$1
N$22
  Top 0.406: R33.2 U$16.P$1
N$23
  Top 0.406: R37.2 U$24.P$1
N$24
  Top 0.406: R36.2 U$23.P$1
N$25
  Top 0.406: R35.2 U$20.P$1
N$26
  Top 0.406: U$18.P$1 R34.2 arc90 R34.2
NRST  (via drill 0.6)
  Top 0.254: IC1.7 23.88,23.63 | NRST.1 C15.1
  Top 0.305: 23.88,23.63 arc-46 24.77,25.72 arc18 25.72,26.99 arc28 26.04,28.26 arc-131 C15.1 | SW1.3 29.87,38.76 arc-90 v29.21,38.1
  Bottom 0.305: v29.21,38.1 arc90 27.43,36.32 NRST.1
NSEL
  Top 0.254: IC1.35 26.38,10.96
  Top 0.305: 29.21,7.06 39.38,7.06 arc90 41.27,8.64 41.27,14.29 arc-34 41.91,18.1 arc31 42.86,21.91 arc16 U$8.9 | 29.21,7.06 29.06,7.06 | 26.38,10.96 26.38,9.89 arc90 29.21,7.06
PGND  (via drill 0.6)
  Top 0.152: v71.19,6.35 71.26,6.25 v71.12,6.35 | v71.12,26.67 71.26,26.75 v71.19,26.67 | v71.19,36.83 71.26,36.75 v71.12,36.83
  Top 0.406: Q2.2 71.19,38.1 R2.1 | Q3.2 71.19,33.02 R3.1 | Q4.2 71.19,27.94 R4.1 | Q6.2 71.19,17.78 R6.1 | Q7.2 71.19,12.7 R7.1 | Q8.2 71.19,7.62 R8.1 | Q9.2 71.19,2.54 R19.1 | R5.1 70.87,22.86 arc90 Q5.2
  Top 0.813: Q2.2 v71.19,36.83 v72.39,36.83 v73.66,36.83 | Q3.2 71.19,31.75 v72.39,31.75 v73.66,31.75 | Q4.2 v71.19,26.67 v72.39,26.67 v73.66,26.67 | Q5.2 71.19,21.59 v72.39,21.59 v73.66,21.59 | Q6.2 71.19,16.51 v72.39,16.51 v73.66,16.51 | Q7.2 71.19,11.43 v72.39,11.43 v73.66,11.43 | Q8.2 v71.19,6.35 v72.39,6.35 v73.66,6.35 | Q9.2 71.19,1.27 v72.39,1.27 v73.66,1.27
  Top 1.27: X2.2 78.32,50.38 arc-90 C17.- | X2.1 arc-90 78.24,57.15 v76.2,57.15 v74.93,57.15 v73.66,57.15 v72.39,57.15
  other vias: 71.12,1.27 71.12,11.43 71.12,16.51 71.12,21.59 71.12,31.75 77.47,48.26 76.2,46.99 77.47,46.99
  pour Bottom (isolate 0.406): 93.98,60.96 60.96,60.96 60.96,0 93.98,0
PVDD
  Top 0.152: D6.C 83.3,17 83.3,16.51 | 85.3,11.5 85.3,11.43 | D5.C 85.05,22 85.05,21.59 | D4.C 83.05,27 83.05,26.67 | D3.C 85.05,32.25 85.05,31.75 | D2.C 83.05,37.25 83.05,36.83 | D1.C 85.05,42.25 85.05,41.91
  Top 0.254: 78.87,41.91 78.87,41.72 arc-90 C28.2 | 76.33,36.83 76.33,36.64 arc-90 C29.2 | 78.87,31.75 78.87,31.56 arc-90 C30.2 | 76.33,26.67 76.33,26.48 arc-90 C31.2 | 78.87,21.59 78.87,21.4 arc-90 C32.2 | 76.33,16.51 76.33,16.32 arc-90 C33.2 | 78.87,11.43 78.87,11.24 arc-90 C34.2 | 76.33,6.35 76.33,6.16 arc-90 C35.2 | 85.09,11.43 85.52,11.43 87.2,11.43 arc90 D7.C
  Top 0.406: U$24.P$4 61.59,6.35 arc-90 60.33,7.62 | U$23.P$4 61.59,11.43 arc-90 60.33,12.7 | U$20.P$4 61.59,16.51 arc-90 60.33,17.78 | U$18.P$4 61.59,21.59 arc-90 60.33,22.86 | U$16.P$4 61.59,26.67 arc-90 60.33,27.94 | U$13.P$4 61.59,31.75 arc-90 60.33,33.02 | U$11.P$4 61.59,36.83 arc-90 60.33,38.1 | U$10.P$4 61.59,41.91 arc-90 60.33,43.18
  Top 0.813: 60.33,7.62 60.33,12.7 60.33,17.78 60.33,22.86 60.33,27.94 60.33,33.02 60.33,38.1 60.33,43.18 60.33,44.45 arc-90 61.28,45.72 C17.+
  Top 1.016: D8.C 83.61,6.35 | C23.A 78.87,11.43 | C24.A 76.33,6.35 | C22.A 76.33,16.51 | C21.A 78.87,21.59 | C20.A 76.33,26.67 | C18.A 76.33,36.83 | C19.A 78.87,31.75 | C25.A 78.87,41.91
  Top 1.27: JP2.15 83.61,6.35 76.33,6.35 | 76.33,16.51 83.3,16.51 JP2.11 | 78.87,21.59 85.05,21.59 JP2.9 | 76.33,26.67 83.05,26.67 JP2.7 | 76.33,36.83 83.05,36.83 JP2.3 | 78.87,31.75 85.05,31.75 JP2.5 | 78.87,11.43 85.09,11.43 85.3,11.43 85.52,11.43 JP2.13 | 78.87,41.91 85.05,41.91 JP2.1 | VJP.2 C17.+
  Bottom 1.27: 86.36,41.91 86.36,36.83 | 86.36,36.83 86.36,31.75 | 86.36,31.75 86.36,26.67 | 86.36,26.67 86.36,21.59 | 86.36,21.59 86.36,16.51 | 86.36,16.51 86.36,11.43 | 86.36,11.43 86.36,6.35 JP2.15 | JP2.13 86.36,11.43 | JP2.11 86.36,16.51 | JP2.9 86.36,21.59 | JP2.7 86.36,26.67 | JP2.5 86.36,31.75 | JP2.3 86.36,36.83 | JP2.1 86.36,41.91 | 86.36,41.91 76.2,41.91 arc-90 C17.+ VJP.2
PVIN
  Top 1.27: X2.3@2 89.32,54.61 | 89.32,54.61 X2.3@1 | VJP.3 arc-90 77.79,54.61 89.32,54.61
PVSS-1
  Top 0.152: C25.C 81.3,39.25 78.76,39.37 | 85.05,39.37 85.05,39 D1.A
  Top 0.254: C28.1 78.74,39.39 arc90 78.76,39.37
  Top 0.813: Q2.3 78.76,39.37
  Top 1.27: 78.76,39.37 85.05,39.37 JP2.2
PVSS-2
  Top 0.152: C18.C 78.8,34.25 76.26,34.29 | 83.05,34.29 83.05,34 D2.A
  Top 0.254: C29.1 76.2,34.29
  Top 0.813: Q3.3 76.2,34.29 76.26,34.29
  Top 1.27: 76.26,34.29 83.05,34.29 JP2.4
PVSS-3
  Top 0.152: C19.C 81.3,29 78.76,29.21 | 85.05,29.21 85.05,29 D3.A
  Top 0.254: C30.1 78.74,29.23 arc90 78.76,29.21
  Top 0.813: Q4.3 78.76,29.21
  Top 1.27: 78.76,29.21 85.05,29.21 JP2.6
PVSS-4
  Top 0.152: C20.C 78.8,24 76.26,24.13 | 83.05,24.13 83.05,23.75 D4.A
  Top 0.254: C31.1 76.2,24.13
  Top 0.813: Q5.3 76.2,24.13 76.26,24.13
  Top 1.27: 76.26,24.13 83.05,24.13 JP2.8
PVSS-5
  Top 0.152: C21.C 81.3,19 78.76,19.05 | 85.05,19.05 85.05,18.75 D5.A
  Top 0.254: C32.1 78.74,19.07 arc90 78.76,19.05
  Top 0.813: Q6.3 78.76,19.05
  Top 1.27: 78.76,19.05 85.05,19.05 JP2.10
PVSS-6
  Top 0.152: C22.C 78.8,14 76.26,13.97 | 83.05,13.97 83.05,13.75 D6.A
  Top 0.254: C33.1 76.2,13.97
  Top 0.813: Q7.3 76.2,13.97 76.26,13.97
  Top 1.27: 76.26,13.97 83.05,13.97 JP2.12
PVSS-7
  Top 0.152: C23.C 81.3,8.75 78.76,8.89 | 85.05,8.89 85.05,8.5 D7.A
  Top 0.254: C34.1 78.74,8.91 arc90 78.76,8.89
  Top 0.813: Q8.3 78.76,8.89
  Top 1.27: 78.76,8.89 85.05,8.89 JP2.14
PVSS-8
  Top 0.152: C24.C 78.8,3.75 76.26,3.81
  Top 0.254: D8.A 82.75,3.81 82.55,3.81 | C35.1 76.2,3.81
  Top 0.813: Q9.3 76.2,3.81 76.26,3.81
  Top 1.27: 76.26,3.81 82.55,3.81 JP2.16
SPI_CLK
  Top 0.254: U$8.6 38.86,16.51 arc-90 37.11,14.76 IC1.39
SPI_IRQ  (via drill 0.6)
  Top 0.254: IC1.36 26.88,9.95 arc90 29.21,7.62 38.1,7.62 arc90 v39.37,8.89 | v37.78,20.32 arc-90 37.59,20.51 U$8.5
  Bottom 0.254: v37.78,20.32 arc90 36.51,19.05 36.51,15.56 arc90 37.47,14.61 arc-90 39.37,12.7 v39.37,8.89
SPI_MISO  (via drill 0.6)
  Top 0.254: IC1.40 36.53,15.26 arc90 v37.78,16.51 | v40.01,16.51 40.01,23.05 arc-90 U$8.7
  Bottom 0.254: v37.78,16.51 v40.01,16.51
SPI_MOSI  (via drill 0.6)
  Top 0.254: IC1.41 36.08,15.76 arc90 36.83,16.51 36.83,17.46 arc-90 v37.78,18.41
  Top 0.305: U$8.8 41.4,19.49 arc-90 v40.96,19.05
  Bottom 0.254: v37.78,18.41 40.32,18.41 arc90 v40.96,19.05
SWCLK
  Top 0.254: IC1.37 30.69,13.76 arc-90 SWD.2
SWDIO
  Top 0.254: IC1.34 25.88,12.93 arc-90 26.42,13.46 26.8,13.46 arc-90 27.56,12.7 | 29.21,10.16 SWD.1
  Top 0.305: 27.56,12.7 27.56,11.81 arc90 29.21,10.16
USART_RX  (via drill 0.6)
  Top 0.254: IC1.43 33.91,16.76 arc90 v33.97,17.14
  Bottom 0.254: USART.2 35.56,10.16 arc-90 33.97,11.43 33.97,16.83 arc90 v33.97,17.14
USART_TX  (via drill 0.6)
  Top 0.254: IC1.42 34.99,16.26 arc90 v35.56,16.83
  Bottom 0.254: v35.56,16.83 35.56,13.97 arc90 USART.1
VDD3.3  (via drill 0.6)
  Top 0.254: 26.88,19.47 arc-90 26.67,19.26 | 21.34,14.48 arc-90 20.62,13.76 IC1.24 | 29.14,23.88 arc-90 C12.1 | IC1.9 22.86,24.13 | 22.23,39.37 22.23,38.73 arc90 22.23,38.73
  Top 0.305: IC1.48 26.67,19.26 23.07,19.26 arc90 21.34,17.53 21.34,14.48 | 26.88,19.47 IC1.1 26.88,21.48 arc-90 C12.1 | 22.86,24.13 arc28 22.28,26.43 arc-53 C11.1
  Top 0.406: R30.2 13.97,3.17 arc-66 v15.24,3.81 | v27.43,23.88 v26.42,23.88 | R18.2 17.78,48.26 arc90 16.51,49.53 | U$8.2 33.78,25.91 arc90 33.02,26.67 29.84,26.67
  Top 0.61: Q1.2 14.97,49.26 arc-90 15.24,49.53
  Top 0.813: 22.23,39.37 arc-90 20.32,41.91 20.32,46.99 arc90 17.78,49.53 16.51,49.53 15.24,49.53 C16.1 | 22.23,38.73 C27.1 C11.1 | 22.23,38.74 22.23,38.73 | 22.23,38.73 arc90 25.4,35.56 27.3,35.56 arc-90 29.84,33.02 29.84,26.67 29.84,24.45 arc-90 C12.1
  Top 1.016: v27.43,23.88 29.14,23.88
  Top 1.27: IC2.4 arc90 29.87,53.34 C26.+ arc90 22.73,50.67 C10.1 C9.1 22.23,39.37
  Bottom 0.61: v27.43,23.88 v26.42,23.88 arc90 25.4,22.86 25.4,10.16 arc-90 22.86,7.62 17.78,7.62 arc90 15.24,5.08 v15.24,3.81
VDDA3.3-ON  (via drill 0.6)
  Top 0.61: Q1.3 arc90 12.7,46.72 v12.7,45.72 v12.7,44.45 | v12.7,44.45 v12.7,43.18 | R1.1 11.43,45.72 arc-90 v12.7,44.45
  Top 0.813: v12.7,43.18 R10.1 | R9.1 v12.7,7.62 v11.43,7.62 | R16.1 v12.7,12.7 v11.43,12.7 | R14.1 v12.7,22.86 v11.43,22.86 | R13.1 v12.7,27.94 v11.43,27.94 | R12.1 v12.7,33.02 v11.43,33.02 | R11.1 v12.7,38.1 v11.43,38.1 | R15.1 v12.7,17.78 v11.43,17.78
  Bottom 0.813: v12.7,38.1 v12.7,43.18 v12.7,44.45 v12.7,45.72 | v12.7,38.1 v12.7,33.02 | v12.7,33.02 v12.7,27.94 | v12.7,27.94 v12.7,22.86 | v12.7,22.86 v12.7,17.78 | v12.7,17.78 v12.7,12.7 | v12.7,12.7 v12.7,7.62 v11.43,7.62 | v12.7,38.1 v11.43,38.1 | v12.7,33.02 v11.43,33.02 | v12.7,27.94 v11.43,27.94 | v12.7,22.86 v11.43,22.86 | v12.7,17.78 v11.43,17.78 | v12.7,12.7 v11.43,12.7
VIN
  Top 1.27: IC2.3 42.83,54.37 arc-90 C13.1 47.58,54.02 arc-90 C14.+ arc-90 49.53,54.61 63.92,54.61 | X1.3@2 63.92,54.61 | 63.92,54.61 X1.3@1 arc90 64.25,50.8 VJP.1
WATER_LEVEL
  Top 0.254: WATER_LEVEL.1 17.78,3.68 | IC1.19 19.43,16.26 arc90 16.26,13.08
  Top 0.305: 17.78,3.68 arc90 17.02,4.45 arc-90 16.26,5.21 16.26,13.08
  Top 0.406: WATER_LEVEL.1 15.81,2.54 arc90 R30.1

### Text on the board
tPlace: IO | RX
tNames: Polivator 1.0 | @ AlexSam @ 2018 | SaeWave.com
tValues: IO | TX